# Altium schematic sheet PWR_TLV71325.SchDoc
size A3
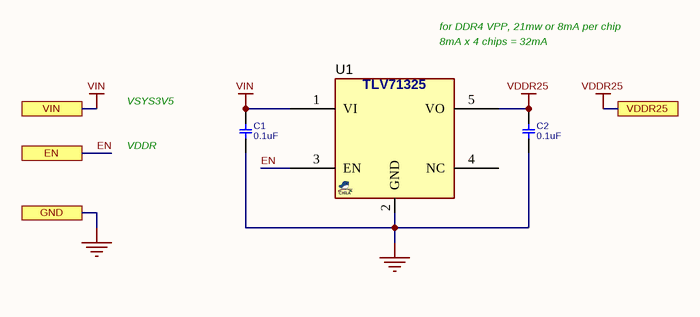
[diagram p0: PWR_TLV71325.SchDoc]

## Parts
C1  0.1uF  [C0402]
C2  0.1uF  [C0402]
U1  TLV71325  [SOT23_5]  (value not drawn)

## Ports
EN, GND, VDDR25, VIN

## Nets
GND: C1.1 C2.1 U1.2(GND) ; port GND
VDDR25: C2.2 U1.5(VO) ; port VDDR25
VIN: C1.2 U1.1(VI) ; port VIN
EN: U1.3(EN) ; port EN

Not connected (* = marked no-connect by the designer): U1 4(NC)

## Notes on the sheet
- for DDR4 VPP, 21mw or 8mA per chip
- 8mA x 4 chips = 32mA
- VDDR
- VSYS3V5

## Library data of the parts
C1 C2 = CAP_SMD_MLCC: CAP, MLCC; PARAM: X5R, 10%; MANF_P#: GRM155R61E104; MANF: Murata; PARAM2: 25v; PRICE: 10,000:$0.006; ASSEMBLY: ASSEMBLY; VALUE: 0.1uF
U1 = VREG_TLV71325_SOT23: REG, Linear, LDO0.23V, 0.15A, 1.4~-5.5VIN, SOT23-5; PARAM2: 1.4~5.5VIN, 2.5V fixed, 65dB PSRR@1KHz; PARAM: LDO0.23V, 0.15A, 1.4~5.5V, -40~125oC; MANF: Texas Instruments; MANF_P#: TLV71325PDBV; PRICE: 0.1$; VALUE: TLV71325